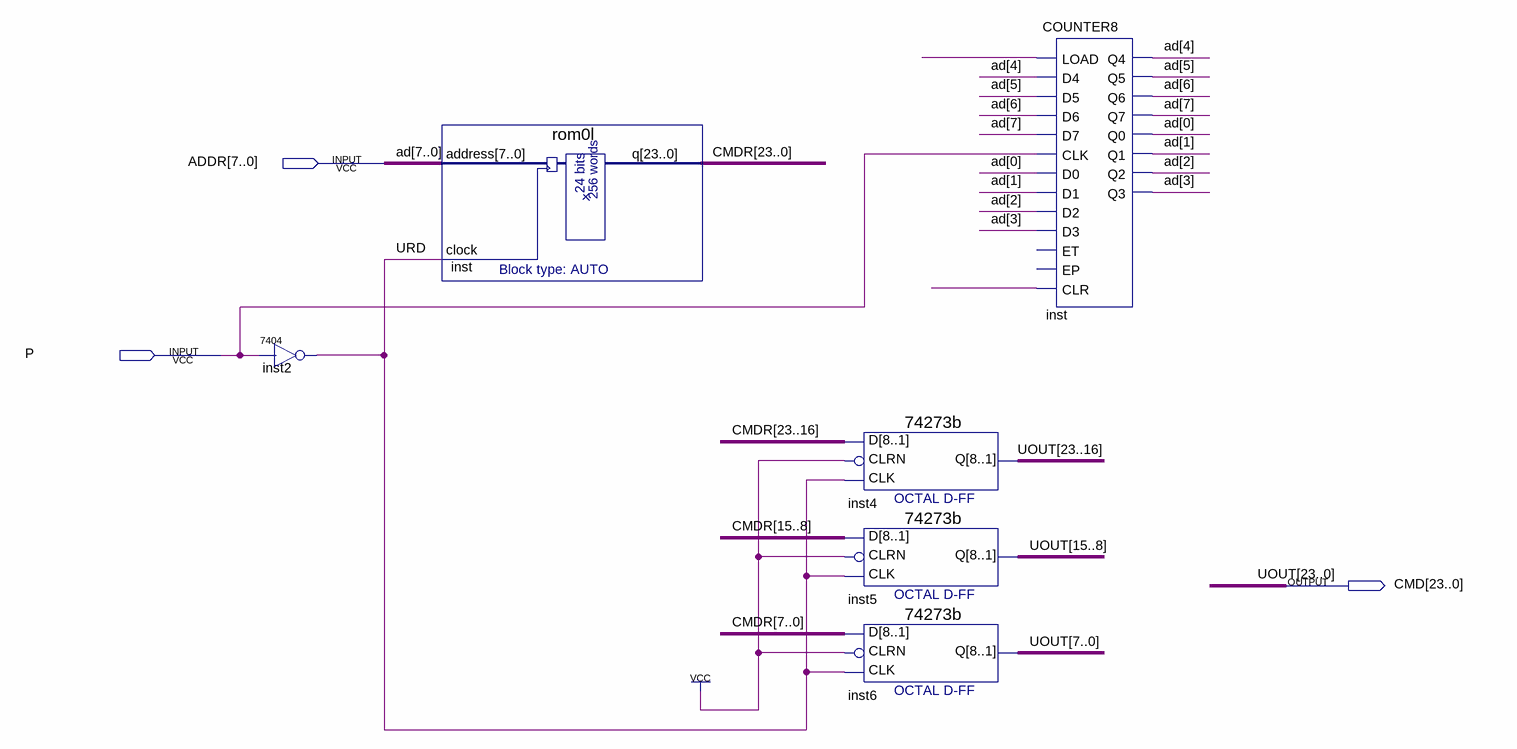
[diagram p0: schematic sheet]
// Quartus schematic exp13.bdf as structural Verilog: 6 symbols, 3 pins
module exp13 (
  input  [7:0] ADDR,
  input  P,
  output [23:0] CMD
);

  wire undriven, undriven_2, URD;
  wire [23:0] CMDR;

  \7404  inst2 (.\2 (P), .\1 (URD));
  rom0l inst (.address(ADDR), .clock(URD), .q(CMDR));
  \74273b  inst4 (.CLK(URD), .D(CMDR[23:16]), .CLRN(1'b1), .Q(CMD[23:16]));
  \74273b  inst5 (.CLK(URD), .D(CMDR[15:8]), .CLRN(1'b1), .Q(CMD[15:8]));
  \74273b  inst6 (.CLK(URD), .D(CMDR[7:0]), .CLRN(1'b1), .Q(CMD[7:0]));
  COUNTER8 inst_dup2 (
    .LOAD(undriven_2), .D4(ADDR[4]), .D5(ADDR[5]), .D6(ADDR[6]), .D7(ADDR[7]), .CLK(P), .D0(ADDR[0]),
    .D1(ADDR[1]), .D2(ADDR[2]), .D3(ADDR[3]), .CLR(undriven), .Q4(ADDR[4]), .Q5(ADDR[5]), .Q6(ADDR[6]),
    .Q7(ADDR[7]), .Q0(ADDR[0]), .Q1(ADDR[1]), .Q2(ADDR[2]), .Q3(ADDR[3]));  // open: ET, EP

  // Other names for the same wires on the sheet: ad[7:0] = ADDR; UOUT[23:0] = CMD
endmodule
